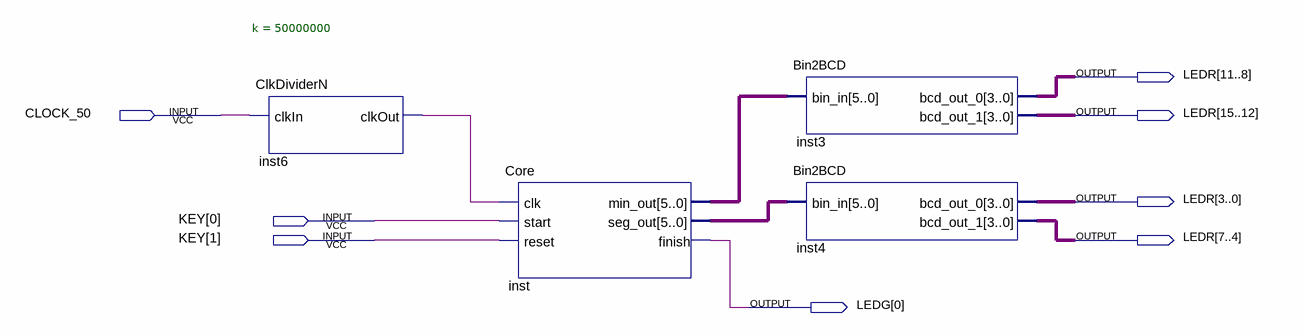
[diagram p0: schematic sheet]
// Quartus schematic mp_esq.bdf as structural Verilog: 4 symbols, 8 pins
module mp_esq (
  input  CLOCK_50,
  input  [1:0] KEY,
  output [15:0] LEDR,
  output [0:0] LEDG
);

  wire inst6_clkout;
  wire [5:0] inst_min_out, inst_seg_out;

  ClkDividerN #(.k(50000000)) inst6 (.clkIn(CLOCK_50), .clkOut(inst6_clkout));
  Core inst (
    .clk(inst6_clkout), .start(KEY[0]), .reset(KEY[1]), .min_out(inst_min_out), .seg_out(inst_seg_out),
    .finish(LEDG[0]));
  Bin2BCD inst3 (.bin_in(inst_min_out), .bcd_out_0(LEDR[11:8]), .bcd_out_1(LEDR[15:12]));
  Bin2BCD inst4 (.bin_in(inst_seg_out), .bcd_out_0(LEDR[3:0]), .bcd_out_1(LEDR[7:4]));
endmodule
